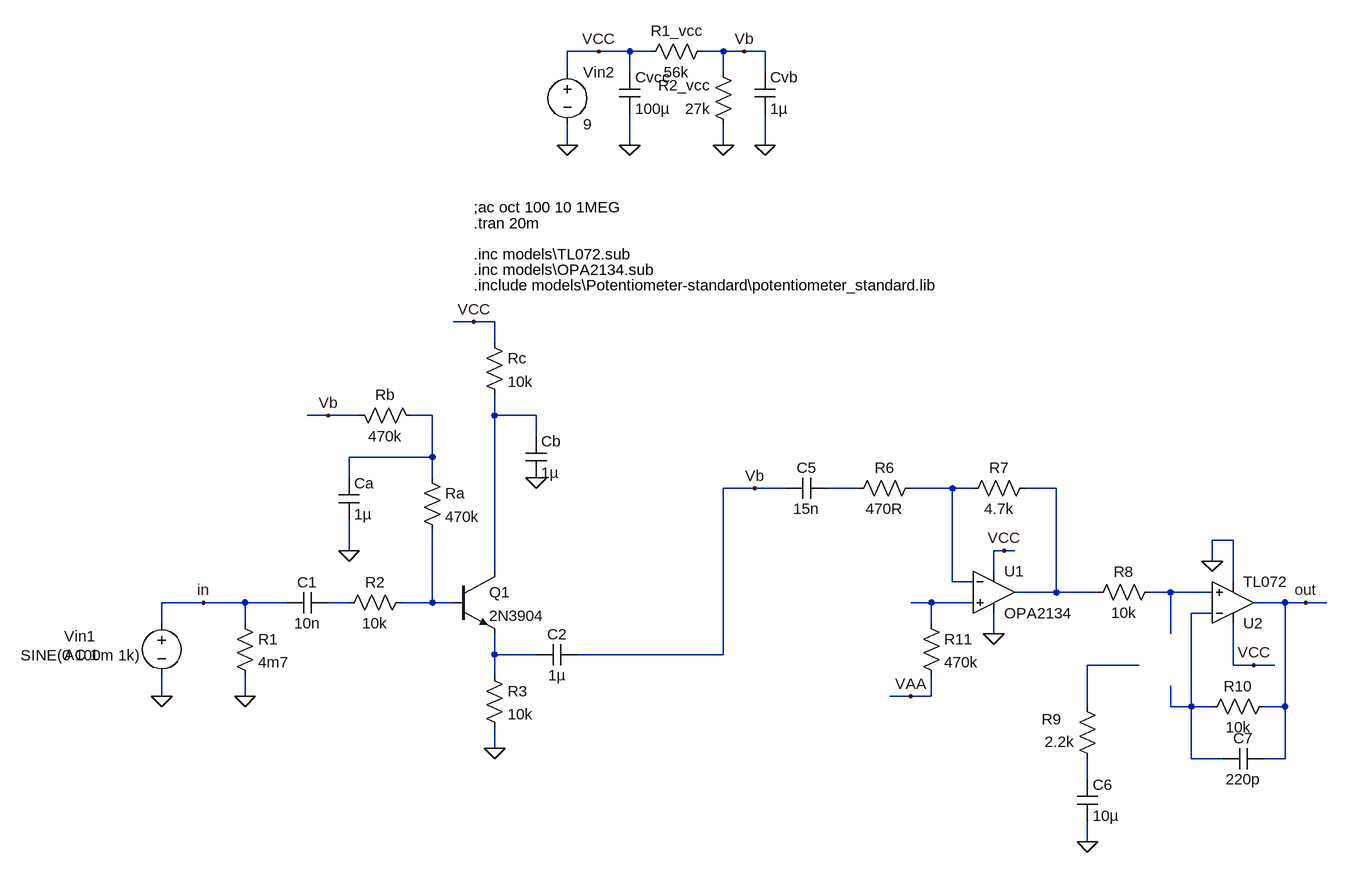
[diagram p0: schematic Ross Compressor.asc]
Ross Compressor.asc, the LTspice schematic file:
Version 4
SHEET 1 880 680
WIRE -1168 -1488 -1216 -1488
WIRE -1120 -1488 -1168 -1488
WIRE -1088 -1488 -1120 -1488
WIRE -976 -1488 -1008 -1488
WIRE -944 -1488 -976 -1488
WIRE -912 -1488 -944 -1488
WIRE -1216 -1456 -1216 -1488
WIRE -1120 -1456 -1120 -1488
WIRE -976 -1456 -976 -1488
WIRE -912 -1456 -912 -1488
WIRE -1216 -1344 -1216 -1376
WIRE -1120 -1344 -1120 -1392
WIRE -976 -1344 -976 -1376
WIRE -912 -1344 -912 -1392
WIRE -1360 -1072 -1392 -1072
WIRE -1328 -1072 -1360 -1072
WIRE -1328 -1040 -1328 -1072
WIRE -1584 -928 -1616 -928
WIRE -1536 -928 -1584 -928
WIRE -1424 -928 -1456 -928
WIRE -1328 -928 -1328 -960
WIRE -1264 -928 -1328 -928
WIRE -1264 -896 -1264 -928
WIRE -1424 -864 -1424 -928
WIRE -1424 -864 -1552 -864
WIRE -1552 -832 -1552 -864
WIRE -1424 -832 -1424 -864
WIRE -928 -816 -976 -816
WIRE -880 -816 -928 -816
WIRE -768 -816 -816 -816
WIRE -624 -816 -688 -816
WIRE -592 -816 -624 -816
WIRE -464 -816 -512 -816
WIRE -192 -736 -224 -736
WIRE -1552 -720 -1552 -768
WIRE -544 -720 -560 -720
WIRE -528 -720 -544 -720
WIRE -224 -704 -224 -736
WIRE -1328 -688 -1328 -928
WIRE -560 -688 -560 -720
WIRE -624 -672 -624 -816
WIRE -592 -672 -624 -672
WIRE -192 -672 -192 -736
WIRE -464 -656 -464 -816
WIRE -464 -656 -528 -656
WIRE -400 -656 -464 -656
WIRE -288 -656 -320 -656
WIRE -224 -656 -288 -656
WIRE -1776 -640 -1840 -640
WIRE -1712 -640 -1776 -640
WIRE -1648 -640 -1712 -640
WIRE -1552 -640 -1584 -640
WIRE -1424 -640 -1424 -752
WIRE -1424 -640 -1472 -640
WIRE -1392 -640 -1424 -640
WIRE -656 -640 -688 -640
WIRE -592 -640 -656 -640
WIRE -112 -640 -160 -640
WIRE -80 -640 -112 -640
WIRE -48 -640 -80 -640
WIRE -224 -624 -256 -624
WIRE -1840 -608 -1840 -640
WIRE -1712 -608 -1712 -640
WIRE -656 -608 -656 -640
WIRE -560 -592 -560 -624
WIRE -288 -592 -288 -656
WIRE -1328 -560 -1328 -592
WIRE -1264 -560 -1328 -560
WIRE -976 -560 -976 -816
WIRE -976 -560 -1200 -560
WIRE -336 -544 -416 -544
WIRE -192 -544 -192 -608
WIRE -160 -544 -192 -544
WIRE -128 -544 -160 -544
WIRE -1328 -528 -1328 -560
WIRE -1840 -496 -1840 -528
WIRE -1712 -496 -1712 -528
WIRE -688 -496 -720 -496
WIRE -656 -496 -656 -528
WIRE -656 -496 -688 -496
WIRE -416 -480 -416 -544
WIRE -288 -480 -288 -512
WIRE -256 -480 -256 -624
WIRE -256 -480 -288 -480
WIRE -224 -480 -256 -480
WIRE -112 -480 -112 -640
WIRE -112 -480 -144 -480
WIRE -1328 -416 -1328 -448
WIRE -256 -400 -256 -480
WIRE -208 -400 -256 -400
WIRE -112 -400 -112 -480
WIRE -112 -400 -144 -400
WIRE -416 -368 -416 -400
WIRE -416 -272 -416 -304
FLAG -1712 -496 0
FLAG -1840 -496 0
FLAG -1776 -640 in
FLAG -1216 -1344 0
FLAG -1120 -1344 0
FLAG -976 -1344 0
FLAG -944 -1488 Vb
FLAG -1168 -1488 VCC
FLAG -912 -1344 0
FLAG -544 -720 VCC
FLAG -560 -592 0
FLAG -688 -496 VAA
FLAG -416 -272 0
FLAG -160 -544 VCC
FLAG -224 -704 0
FLAG -80 -640 out
FLAG -928 -816 Vb
FLAG -1328 -416 0
FLAG -1552 -720 0
FLAG -1584 -928 Vb
FLAG -1360 -1072 VCC
FLAG -1264 -832 0
SYMBOL res -1728 -624 R0
SYMATTR InstName R1
SYMATTR Value 4m7
SYMBOL voltage -1840 -624 R0
WINDOW 0 -150 36 Left 2
WINDOW 3 -217 65 Left 2
WINDOW 123 -150 64 Left 2
WINDOW 39 0 0 Left 2
SYMATTR InstName Vin1
SYMATTR Value SINE(0 100m 1k)
SYMATTR Value2 AC 1
SYMBOL res -1456 -656 R90
WINDOW 0 0 56 VBottom 2
WINDOW 3 32 56 VTop 2
SYMATTR InstName R2
SYMATTR Value 10k
SYMBOL cap -1584 -656 R90
WINDOW 0 0 32 VBottom 2
WINDOW 3 32 32 VTop 2
SYMATTR InstName C1
SYMATTR Value 10n
SYMBOL res -672 -624 R0
SYMATTR InstName R11
SYMATTR Value 470k
SYMBOL Opamps\\opamp2 -560 -720 R0
SYMATTR InstName U1
SYMATTR Value OPA2134
SYMBOL voltage -1216 -1472 R0
WINDOW 123 0 0 Left 2
WINDOW 39 0 0 Left 2
SYMATTR InstName Vin2
SYMATTR Value 9
SYMBOL cap -1136 -1456 R0
SYMATTR InstName Cvcc
SYMATTR Value 100µ
SYMBOL res -992 -1504 R90
WINDOW 0 0 56 VBottom 2
WINDOW 3 32 56 VTop 2
SYMATTR InstName R1_vcc
SYMATTR Value 56k
SYMBOL res -960 -1360 R180
WINDOW 0 36 76 Left 2
WINDOW 3 36 40 Left 2
SYMATTR InstName R2_vcc
SYMATTR Value 27k
SYMBOL cap -928 -1456 R0
SYMATTR InstName Cvb
SYMATTR Value 1µ
SYMBOL res -672 -832 R90
WINDOW 0 0 56 VBottom 2
WINDOW 3 32 56 VTop 2
SYMATTR InstName R6
SYMATTR Value 470R
SYMBOL res -496 -832 R90
WINDOW 0 0 56 VBottom 2
WINDOW 3 32 56 VTop 2
SYMATTR InstName R7
SYMATTR Value 4.7k
SYMBOL cap -816 -832 R90
WINDOW 0 0 32 VBottom 2
WINDOW 3 32 32 VTop 2
SYMATTR InstName C5
SYMATTR Value 15n
SYMBOL res -304 -672 R90
WINDOW 0 0 56 VBottom 2
WINDOW 3 32 56 VTop 2
SYMATTR InstName R8
SYMATTR Value 10k
SYMBOL res -432 -496 R0
WINDOW 0 -54 35 Left 2
WINDOW 3 -50 70 Left 2
SYMATTR InstName R9
SYMATTR Value 2.2k
SYMBOL cap -432 -368 R0
SYMATTR InstName C6
SYMATTR Value 10µ
SYMBOL Opamps\\opamp2 -192 -576 M180
SYMATTR InstName U2
SYMATTR Value TL072
SYMBOL res -128 -496 R90
WINDOW 0 0 56 VBottom 2
WINDOW 3 32 56 VTop 2
SYMATTR InstName R10
SYMATTR Value 10k
SYMBOL cap -144 -416 R90
WINDOW 0 0 32 VBottom 2
WINDOW 3 32 32 VTop 2
SYMATTR InstName C7
SYMATTR Value 220p
SYMBOL npn -1392 -688 R0
SYMATTR InstName Q1
SYMATTR Value 2N3904
SYMBOL res -1344 -544 R0
SYMATTR InstName R3
SYMATTR Value 10k
SYMBOL res -1440 -848 R0
SYMATTR InstName Ra
SYMATTR Value 470k
SYMBOL cap -1568 -832 R0
SYMATTR InstName Ca
SYMATTR Value 1µ
SYMBOL res -1440 -912 M270
WINDOW 0 32 56 VTop 2
WINDOW 3 0 56 VBottom 2
SYMATTR InstName Rb
SYMATTR Value 470k
SYMBOL res -1344 -1056 R0
SYMATTR InstName Rc
SYMATTR Value 10k
SYMBOL cap -1280 -896 R0
SYMATTR InstName Cb
SYMATTR Value 1µ
SYMBOL cap -1200 -576 R90
WINDOW 0 0 32 VBottom 2
WINDOW 3 32 32 VTop 2
SYMATTR InstName C2
SYMATTR Value 1µ
TEXT -1360 -1224 Left 2 !.tran 20m
TEXT -1360 -1176 Left 2 !.inc models\\TL072.sub
TEXT -1360 -1248 Left 2 !;ac oct 100 10 1MEG
TEXT -1360 -1152 Left 2 !.inc models\\OPA2134.sub
TEXT -1360 -1128 Left 2 !.include models\\Potentiometer-standard\\potentiometer_standard.lib

The netlist it stands for:
* Ross Compressor.asc
R1 in 0 4m7
Vin1 in 0 SINE(0 100m 1k) AC 1
R2 N008 N007 10k
C1 N007 in 10n
R11 N009 VAA 470k
XU1 N009 N004 VCC 0 N005 OPA2134  ; pins In+ In- V+ V- OUT
Vin2 VCC 0 9
Cvcc VCC 0 100µ
R1_vcc Vb VCC 56k
R2_vcc 0 Vb 27k
Cvb Vb 0 1µ
R6 N004 N003 470R
R7 N005 N004 4.7k
C5 N003 Vb 15n
R8 N006 N005 10k
R9 N012 N013 2.2k
C6 N013 0 10µ
XU2 N006 N010 VCC 0 out TL072  ; pins In+ In- V+ V- OUT
R10 out N010 10k
C7 out N010 220p
Q1 N002 N008 N011 0 2N3904
R3 N011 0 10k
Ra N001 N008 470k
Ca N001 0 1µ
Rb N001 Vb 470k
Rc VCC N002 10k
Cb N002 0 1µ
C2 Vb N011 1µ
.model NPN NPN
.model PNP PNP
.lib standard.bjt
.tran 20m
.inc models\TL072.sub
;ac oct 100 10 1MEG
.inc models\OPA2134.sub
.include models\Potentiometer-standard\potentiometer_standard.lib
.backanno
.end